# Altium schematic sheet PG01_BLE Module.SchDoc: Smart Ring (Concept)
size B; DocumentNumber: 1; SheetNumber: 1; SheetTotal: 3
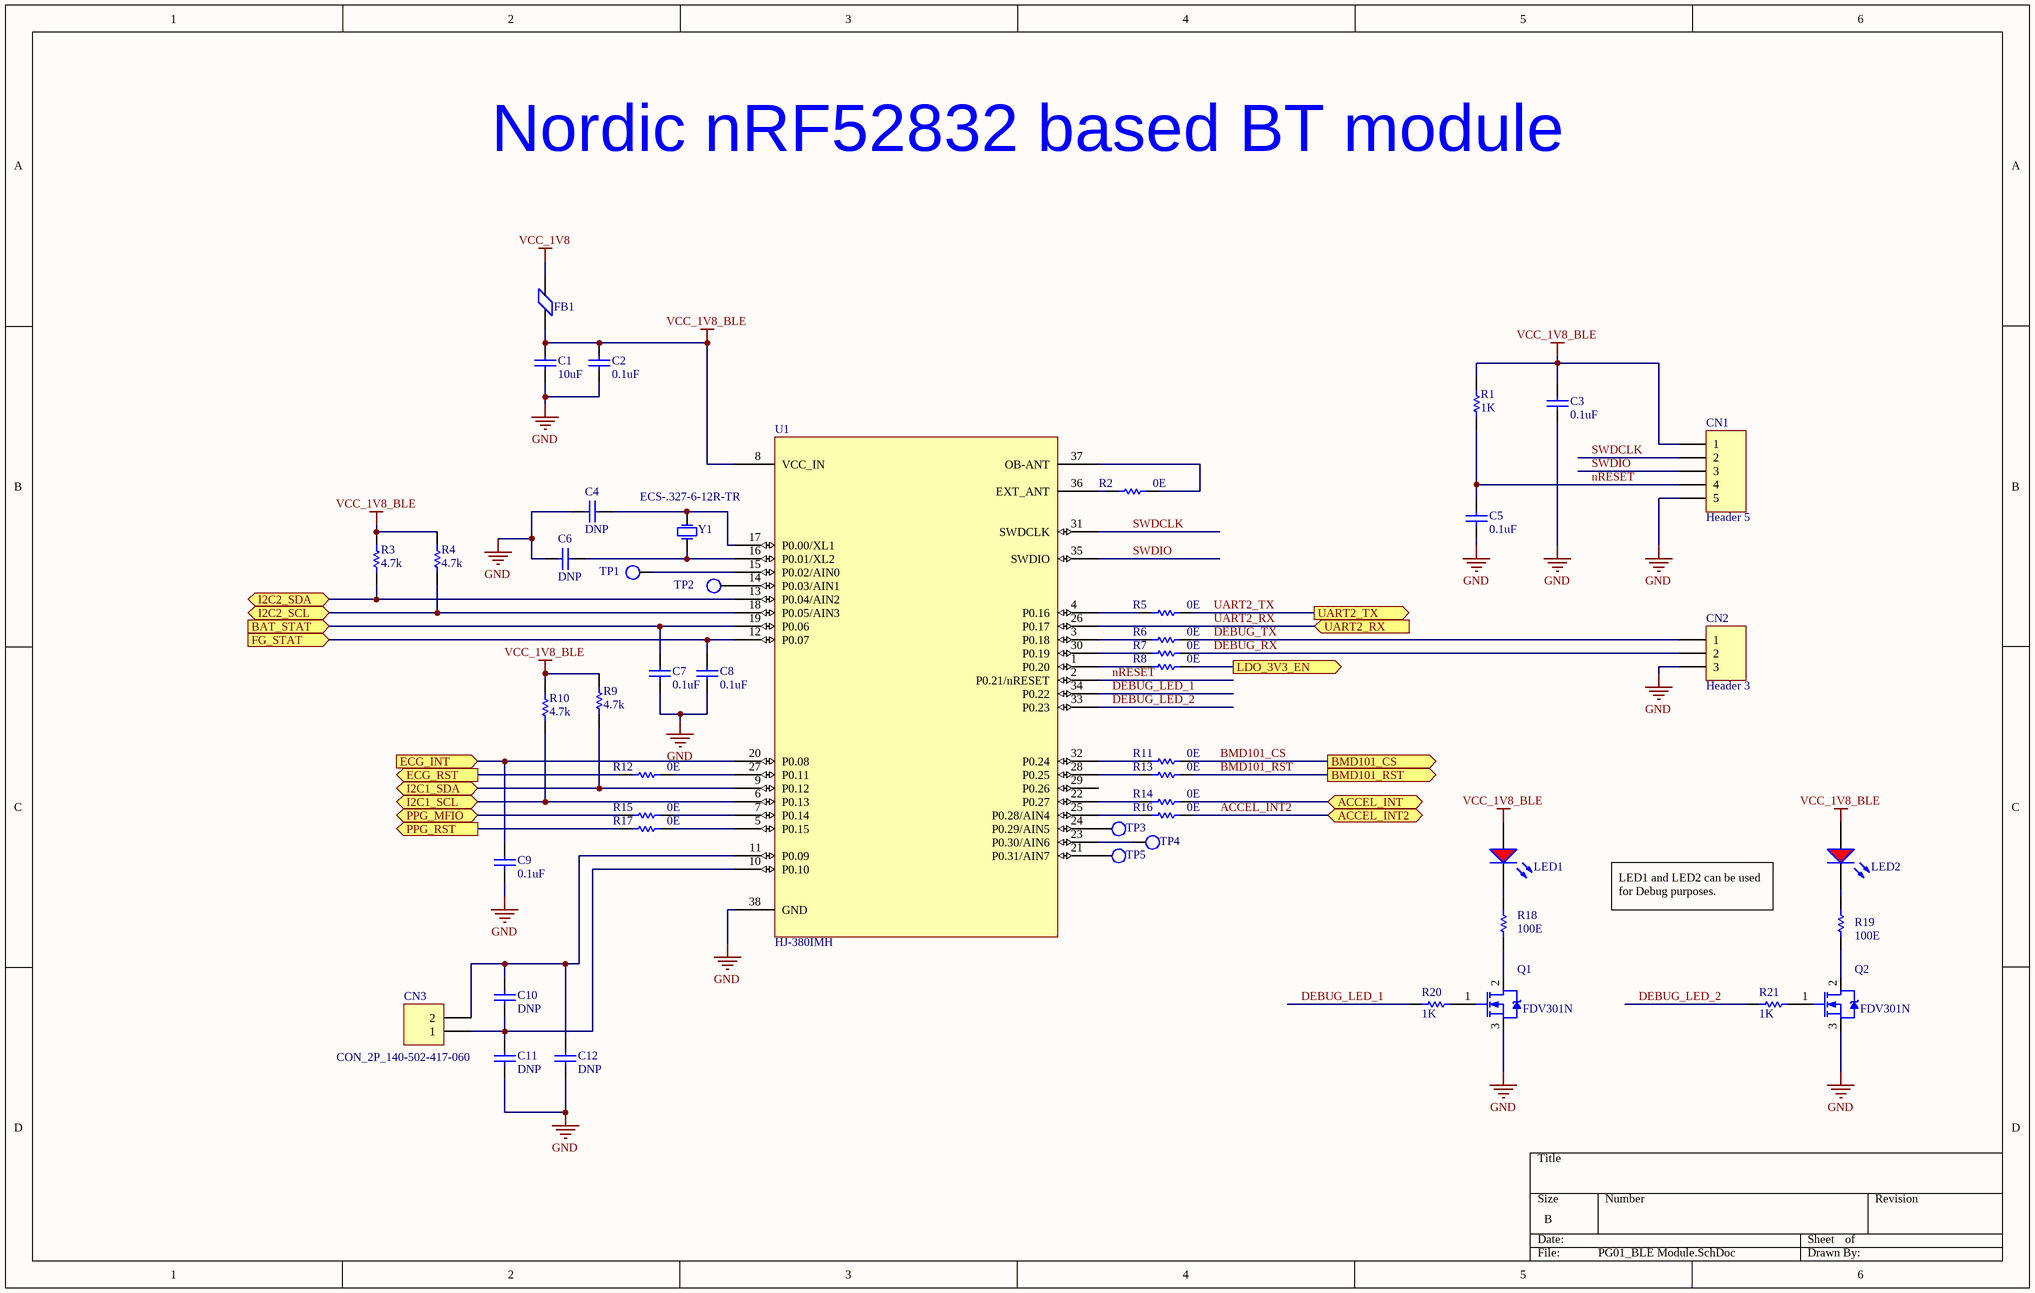
[diagram p0: PG01_BLE Module.SchDoc]

## Parts
C1  10uF  [0805C]
C2  0.1uF  [0402C]
C3  0.1uF  [0402C]
C4  DNP  [0402C]
C5  0.1uF  [0402C]
C6  DNP  [0402C]
C7  0.1uF  [0402C]
C8  0.1uF  [0402C]
C9  0.1uF  [0402C]
C10  DNP  [0402C]
C11  DNP  [0402C]
C12  DNP  [0402C]
CN1  Header 5  [HDR1X5]
CN2  Header 3  [HDR1X3]
CN3  CON_2P_140-502-417-060  [140-502-417-060]
FB1  Ferrite Bead  [0402R]  (value not drawn)
LED1  5988A10107F  [0402R]  (value not drawn)
LED2  5988A10107F  [0402R]  (value not drawn)
Q1  FDV301N  [SOT_23]
Q2  FDV301N  [SOT_23]
R1  1K  [0402R]
R2  0E  [0402R]
R3  4.7k  [0402R]
R4  4.7k  [0402R]
R5  0E  [0402R]
R6  0E  [0402R]
R7  0E  [0402R]
R8  0E  [0402R]
R9  4.7k  [0402R]
R10  4.7k  [0402R]
R11  0E  [0402R]
R12  0E  [0402R]
R13  0E  [0402R]
R14  0E  [0402R]
R15  0E  [0402R]
R16  0E  [0402R]
R17  0E  [0402R]
R18  100E  [0402R]
R19  100E  [0402R]
R20  1K  [0402R]
R21  1K  [0402R]
TP1  Test_Point  [TP]  (value not drawn)
TP2  Test_Point  [TP]  (value not drawn)
TP3  Test_Point  [TP]  (value not drawn)
TP4  Test_Point  [TP]  (value not drawn)
TP5  Test_Point  [TP]  (value not drawn)
U1  HJ-380IMH  [HJ-380IMH]
Y1  ECS-.327-6-12R-TR  [ECS-.327-6-12R-TR]

## Ports
ACCEL_INT2 (bidir), ACCEL_INT (bidir), BAT_STAT (in), BMD101_CS (out), BMD101_RST (out), ECG_INT (in), ECG_RST (out), FG_STAT (in), I2C1_SCL (bidir), I2C1_SDA (bidir), I2C2_SCL (bidir), I2C2_SDA (bidir), LDO_3V3_EN (out), PPG_MFIO (bidir), PPG_RST (out), UART2_RX (in), UART2_TX (out)

## Nets
GND: C1.1 C2.1 C3.2 C4.2 C5.2 C6.2 C7.1 C8.1 C9.1 C11.1 C12.1 CN1.5 CN2.3 Q1.3(S) Q2.3(S) U1.38(GND)
VCC_1V8: FB1.2(VREF)
VCC_1V8_BLE: C1.2 C2.2 C3.1 CN1.1 FB1.1(VREF) LED1.1(A) LED2.1(A) R1.2 R3.2 R4.2 R9.2 R10.2 U1.8(VCC_IN)
ACCEL_INT: R14.2 ; port ACCEL_INT
ACCEL_INT2: R16.2 ; port ACCEL_INT2
BAT_STAT: C7.2 U1.19(P0.06) ; port BAT_STAT
BMD101_CS: R11.2 ; port BMD101_CS
BMD101_RST: R13.2 ; port BMD101_RST
DEBUG_LED_1: R20.1 U1.34(P0.22)
DEBUG_LED_2: R21.1 U1.33(P0.23)
DEBUG_RX: CN2.2 R7.2
DEBUG_TX: CN2.1 R6.2
ECG_INT: C9.2 U1.20(P0.08) ; port ECG_INT
ECG_RST: R12.1 ; port ECG_RST
FG_STAT: C8.2 U1.12(P0.07) ; port FG_STAT
I2C1_SCL: R10.1 U1.6(P0.13) ; port I2C1_SCL
I2C1_SDA: R9.1 U1.9(P0.12) ; port I2C1_SDA
I2C2_SCL: R4.1 U1.18(P0.05/AIN3) ; port I2C2_SCL
I2C2_SDA: R3.1 U1.13(P0.04/AIN2) ; port I2C2_SDA
LDO_3V3_EN: R8.2 ; port LDO_3V3_EN
nRESET: C5.1 CN1.4 R1.1 U1.2(P0.21/nRESET)
PPG_MFIO: R15.1 ; port PPG_MFIO
PPG_RST: R17.1 ; port PPG_RST
SWDCLK: CN1.2 U1.31(SWDCLK)
SWDIO: CN1.3 U1.35(SWDIO)
UART2_RX: U1.26(P0.17) ; port UART2_RX
UART2_TX: R5.2 ; port UART2_TX
NetC4_1: C4.1 U1.17(P0.00/XL1) Y1.2(OSC2)
NetC6_1: C6.1 U1.16(P0.01/XL2) Y1.1(OSC1)
NetC10_1: C10.1 C11.2 CN3.1 U1.10(P0.10)
NetC10_2: C10.2 C12.2 CN3.2 U1.11(P0.09)
NetLED1_2: LED1.2(K) R18.2
NetLED2_2: LED2.2(K) R19.2
NetQ1_1: Q1.1(G) R20.2
NetQ1_2: Q1.2(D) R18.1
NetQ2_1: Q2.1(G) R21.2
NetQ2_2: Q2.2(D) R19.1
NetR2_1: R2.1 U1.36(EXT_ANT)
NetR2_2: R2.2 U1.37(OB-ANT)
NetR5_1: R5.1 U1.4(P0.16)
NetR6_1: R6.1 U1.3(P0.18)
NetR7_1: R7.1 U1.30(P0.19)
NetR8_1: R8.1 U1.1(P0.20)
NetR11_1: R11.1 U1.32(P0.24)
NetR12_2: R12.2 U1.27(P0.11)
NetR13_1: R13.1 U1.28(P0.25)
NetR14_1: R14.1 U1.22(P0.27)
NetR15_2: R15.2 U1.7(P0.14)
NetR16_1: R16.1 U1.25(P0.28/AIN4)
NetR17_2: R17.2 U1.5(P0.15)
NetTP1_1: TP1.1 U1.15(P0.02/AIN0)
NetTP2_1: TP2.1 U1.14(P0.03/AIN1)
NetTP3_1: TP3.1 U1.24(P0.29/AIN5)
NetTP4_1: TP4.1 U1.23(P0.30/AIN6)
NetTP5_1: TP5.1 U1.21(P0.31/AIN7)

Not connected (* = marked no-connect by the designer): U1 29(P0.26)

## Notes on the sheet
- Nordic nRF52832 based BT module
- LED1 and LED2 can be used for Debug purposes.

## Library data of the parts
C1 = CAP_0805_10uF_16V: CAP CER 10UF 16V X7R 0805; Alternate MFR: Taiyo Yuden; Alternate MPN: EMK212BB7106MG-T; Package: 0805; Value: 10uF
C2 C3 C5 C7-C9 = CAP_0402_0.1uF_50V: CAP CER 0.1UF 50V X7R 0402; Alternate MFR: Samsung Electro-Mechanics; Alternate MPN: CL05B104KB54PNC; Package: 0402; Value: 0.1uF
C4 C6 C10-C12 = CAP_0402_DNP: CAP CER DNP 0402; MFR: Generic; MPN: Generic; Package: 0402; Value: DNP
CN1 = CON_5P_CI0105M1HR0-NH: 5 POS 2.00MM(.079) SINGLE ROW SM; MFR: Cvilux USA; MPN: CI0105M1HR0-NH
CN2 = CON_3P_CI0103M1HR0-NH: 3 POS 2.00MM(.079) SINGLE ROW SM; MFR: Cvilux USA; MPN: CI0103M1HR0-NH
CN3 = CON_2P_140-502-417-060: 2.0MM PITCH CONNECTOR WITH 2 SUR; MFR: EDAC Inc.; MPN: 140-502-417-060
FB1 = Ferrite Bead: CHIP BEAD 600 OHM 0402 300mA; MFR: Walsin; MPN: WLBD1005K2U601TP; Package: 0402
LED1 LED2 = LED_Red: Red LED; MFR: Dialight; Forward Voltage: 1.6V; Value: Red; Package: 0402; MPN: 5988A10107F
Q1 Q2 = NMOS_FDV301N: MOSFET N-CH 25V 220MA SOT23; MFR: onsemi; ComponentLink1Description: Manufacturer Link; ComponentLink1URL: http://www.irf.com/; MPN: FDV301N; Package: SOT23
R1 R20 R21 = RES_0402_1k: RES SMD 1K OHM 1% 1/16W 0402; MFR: Generic; Alternate MFR: YAGEO; Alternate MPN: AC0402FR-071KL; MPN: Generic; Package: 0402; Value: 1K
R2 R5-R8 R11-R17 = RES_0402_0E: RES 0 OHM JUMPER 1/16W 0402; MFR: Generic; Alternate MFR: YAGEO; Alternate MPN: AC0402JR-130RL; MPN: Generic; Package: 0402; Value: 0E
R3 R4 R9 R10 = RES_0402_4.7k: RES 4.7K OHM 1% 1/16W 0402; MFR: Generic; Alternate MFR: YAGEO; Alternate MPN: RC0402FR-134K7L; MPN: Generic; Package: 0402; Value: 4.7k
R18 R19 = RES_0402_100E: RES 100 OHM 1% 1/16W 0402; MFR: Generic; Alternate MFR: YAGEO; Alternate MPN: RC0402FR-13100RL; MPN: Generic; Package: 0402; Value: 100E
U1 = BLE Module_HJ-380IMH: Chip-scale high performance ultra small (5.5mmX6mm) ultra low power / Bluetooth 5.0 module based on Nordic nRF52832; MFR: TangShan HongJia Electronic Technology Co., Ltd; MPN: HJ-380IMH
Y1 = XTAL_32.768kHz: CRYSTAL 32.7680KHZ 6PF SMD; MFR: ECS Inc.; MPN: ECS-.327-6-12R-TR; Capacitance: 6pF; Value: 32.768kHz